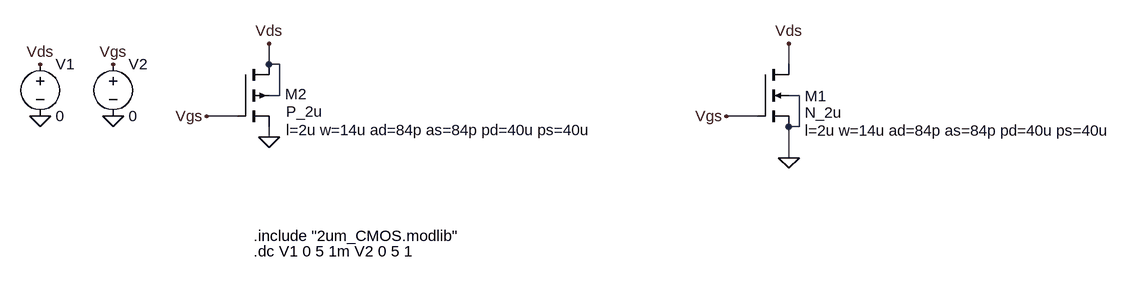
[diagram p0: schematic 1b.asc]
1b.asc, the LTspice schematic file:
Version 4
SHEET 1 1296 680
WIRE -64 112 -64 80
WIRE -48 112 -64 112
WIRE 736 112 736 80
WIRE -48 160 -48 112
WIRE -48 160 -64 160
WIRE 752 160 736 160
WIRE -112 192 -160 192
WIRE 688 192 640 192
WIRE 752 208 752 160
WIRE 752 208 736 208
WIRE -64 224 -64 208
WIRE 736 256 736 208
FLAG -160 192 Vgs
FLAG -64 80 Vds
FLAG 736 80 Vds
FLAG 640 192 Vgs
FLAG -64 224 0
FLAG 736 256 0
FLAG -304 192 0
FLAG -416 192 0
FLAG -416 112 Vds
FLAG -304 112 Vgs
SYMBOL nmos4 688 112 R0
WINDOW 0 73 49 Left 2
WINDOW 3 73 74 Left 2
WINDOW 123 73 102 Left 2
SYMATTR InstName M1
SYMATTR Value N_2u
SYMATTR Value2 l=2u w=14u ad=84p as=84p pd=40u ps=40u
SYMBOL pmos4 -112 112 R0
WINDOW 0 73 46 Left 2
WINDOW 3 74 73 Left 2
WINDOW 123 74 101 Left 2
SYMATTR InstName M2
SYMATTR Value P_2u
SYMATTR Value2 l=2u w=14u ad=84p as=84p pd=40u ps=40u
SYMBOL voltage -416 96 R0
WINDOW 123 0 0 Left 0
WINDOW 39 0 0 Left 0
SYMATTR InstName V1
SYMATTR Value 0
SYMBOL voltage -304 96 R0
WINDOW 123 0 0 Left 0
WINDOW 39 0 0 Left 0
SYMATTR InstName V2
SYMATTR Value 0
TEXT -88 376 Left 2 !.include "2um_CMOS.modlib"
TEXT -88 400 Left 2 !.dc V1 0 5 1m V2 0 5 1

The netlist it stands for:
* 1b.asc
M1 Vds Vgs 0 0 N_2u l=2u w=14u ad=84p as=84p pd=40u ps=40u
M2 Vds Vgs 0 Vds P_2u l=2u w=14u ad=84p as=84p pd=40u ps=40u
V1 Vds 0 0
V2 Vgs 0 0
.model NMOS NMOS
.model PMOS PMOS
.lib standard.mos
.include "2um_CMOS.modlib"
.dc V1 0 5 1m V2 0 5 1
.backanno
.end